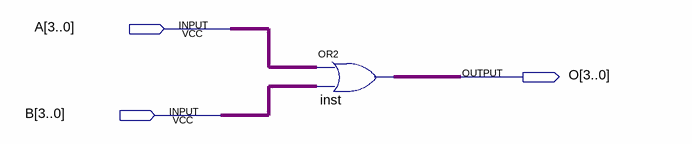
[diagram p0: schematic sheet]
// Quartus schematic or_logic.bdf as structural Verilog: 1 symbols, 3 pins
module or_logic (
  input  [3:0] A,
  input  [3:0] B,
  output [3:0] O
);

  assign O = A | B;  // OR2 inst, 4 bits wide
endmodule
